# Altium schematic sheet RX_LNA_Preamp.SchDoc
size A4; SheetNumber: 11; SheetTotal: 13
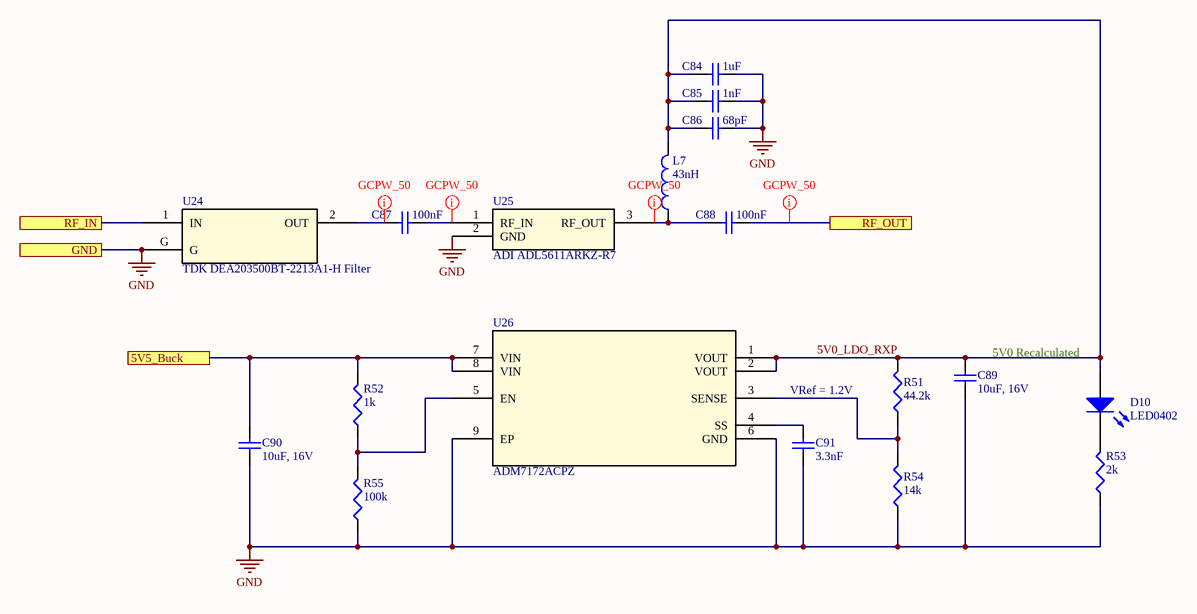
[diagram p0: RX_LNA_Preamp.SchDoc]

## Parts
C84  1uF  [SMD-0402]
C85  1nF  [SMD-0402]
C86  68pF  [SMD-0402]
C87  100nF  [SMD-0402]
C88  100nF  [SMD-0402]
C89  10uF, 16V  [SMD-0603]
C90  10uF, 16V  [SMD-0603]
C91  3.3nF  [Johanson-0201]
D10  LED0402  [LED-0402]
L7  43nH  [SMD-0603]
R51  44.2k  [SMD-0402]
R52  1k  [SMD-0402]
R53  2k  [SMD-0402]
R54  14k  [SMD-0402]
R55  100k  [SMD-0402]
U24  TDK DEA203500BT-2213A1-H Filter  [TDK DEA203500BT-2213A1-H Bandpass Filter]
U25  ADI ADL5611ARKZ-R7  [Analog Devices ADL5545ARKZ]
U26  ADM7172ACPZ  [ADM7172_VIA_NOSILK]

## Ports
5V5_Buck, GND, RF_IN, RF_OUT

## Nets
GND: C84.1 C85.1 C86.1 C89.1 C90.1 C91.1 R53.1 R54.1 R55.1 U24.G U25.2(GND) U26.6(GND) U26.9(EP) ; port GND
5V0_LDO_RXP: C84.2 C85.2 C86.2 C89.2 D10.1(A) L7.2 R51.2 U26.1(VOUT) U26.2(VOUT)
5V5_Buck: C90.2 R52.2 U26.7(VIN) U26.8(VIN) ; port 5V5_Buck
RF_IN: U24.1(IN) ; port RF_IN
RF_OUT: C88.1 ; port RF_OUT
NetC87_1: C87.1 U25.1(RF_IN)
NetC87_2: C87.2 U24.2(OUT)
NetC88_2: C88.2 L7.1 U25.3(RF_OUT)
NetC91_2: C91.2 U26.4(SS)
NetD10_2: D10.2(K) R53.2
NetR51_1: R51.1 R54.2 U26.3(SENSE)
NetR52_1: R52.1 R55.2 U26.5(EN)

## Layout directives
net class GCPW_50: NetC87_1, NetC87_2, NetC88_2, RF_OUT

## Notes on the sheet
- 5V0 Recalculated
- VRef = 1.2V

## Library data of the parts
C84-C88 = CAP0402: Ceramic Capacitor 0402
C89 C90 = CAP0603: Ceramic Capacitor 0603
C91 = CAP0201: Capacitor 0201 Imperial
D10 = LED0402: LED 0402
L7 = L0603: Inductor 0603
R51-R55 = RES0402: Resistor-0402
U24 = TDK DEA203500BT-2213A1-H Filter: 3.5 GHz Center Freq BPF; Mfr_Name: TDK; RefDes: RefDes; Type: Type
U25 = ADI ADL5611ARKZ-R7: IC AMP W-CDMA 30MHZ-6GHZ SOT89-3; Mfr_Name: Analog Devices Inc; RefDes: RefDes; Type: Type
U26 = ADM7172ACPZ: 6.5V, 2A, Ultralow Noise, High PSRR, Fast Transient Response CMOS LDO; Value: Value; Type: Type; RefDes: RefDes